# Altium schematic sheet 09. NET_Interface.SchDoc
size A4; CheckedBy: 黄钦宁; Author: 陈坤; DocumentNumber: 9; SheetNumber: 9; SheetTotal: 13; PageSetup: Record=PageOptions|CenterHorizontal=True|CenterVertical=True|PrintScale=1.00|XCorrection=1.00|YCorrection=1.00|PrintKind=0|BorderSize=5000000|LeftOffset=0|BottomOffset=0|Orientation=2|PaperLength=1000|PaperWidth=1000|Scale=100|PaperSource=7|PrintQuality=600|MediaType=1|DitherType=10|PaperKind=A4|PrintScaleMode=1; DesignDate: 2013-08-16; CheckDate: 2013-12-28; SheetName: NET_Interface; SheetVersion: V1.00; SheetDescription: NET_Interface; ProductName: EasyARM-iMX28学习套件; ProductModel: EasyARM-iMX283
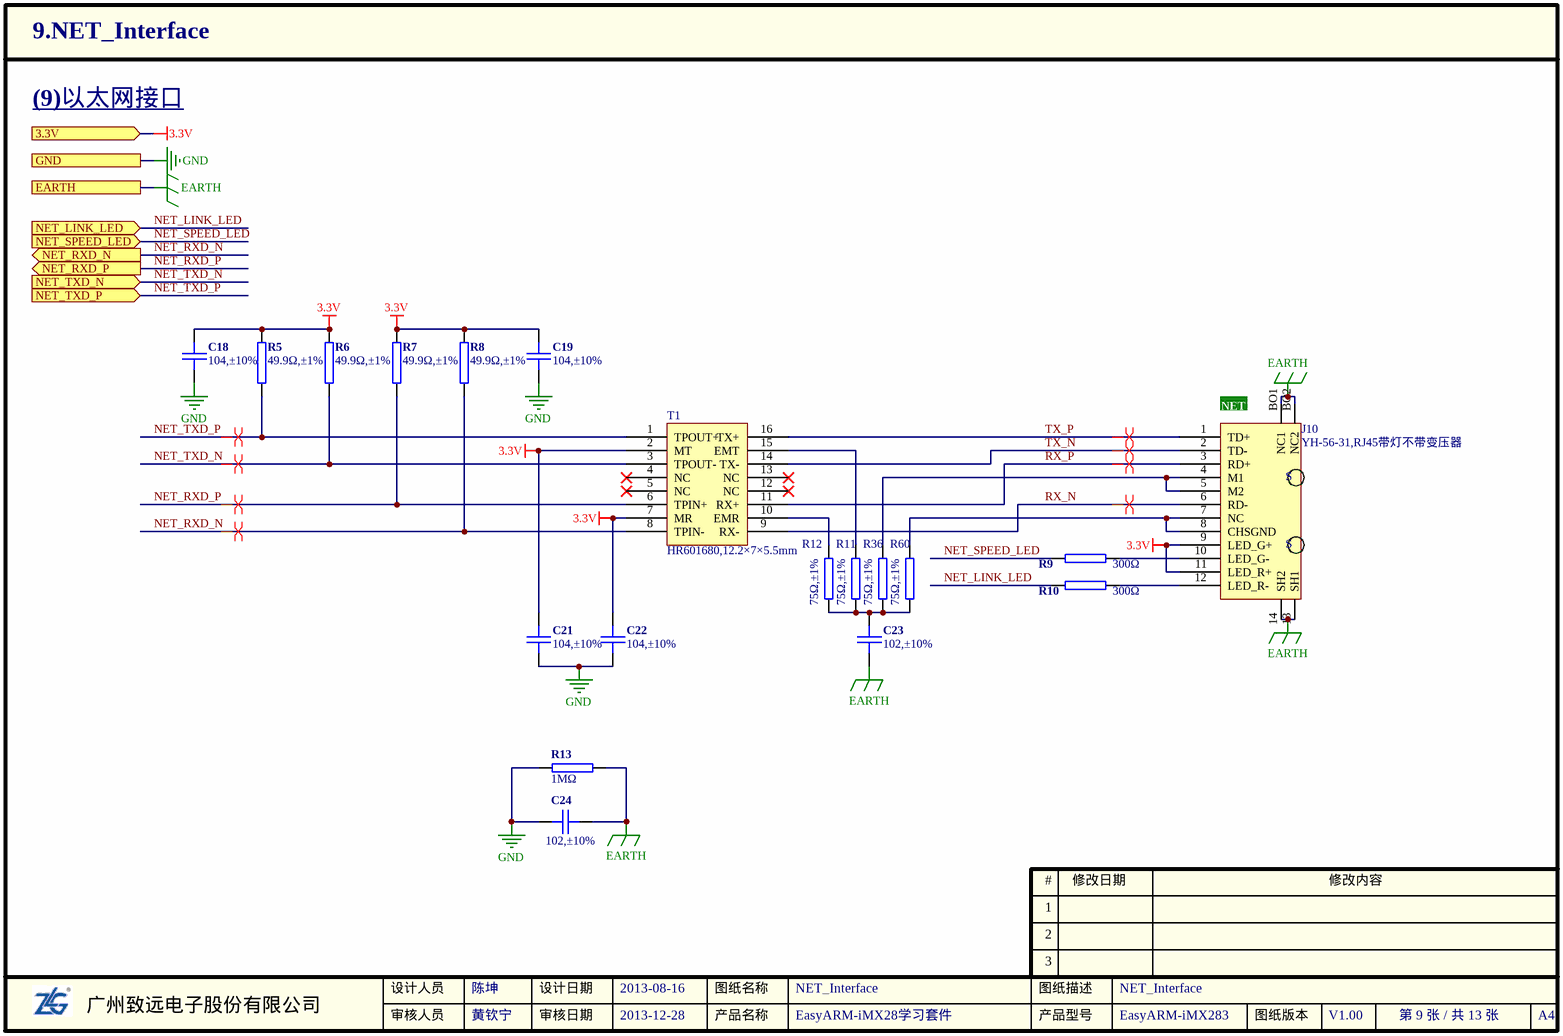
[diagram p0: 09. NET_Interface.SchDoc]

## Parts
C18  104,±10%  [0603C]
C19  104,±10%  [0603C]
C21  104,±10%  [0603C]
C22  104,±10%  [0603C]
C23  102,±10%  [1206C]
C24  102,±10%  [1206C]
J10  value YH-56-31,RJ45带灯不带变压器  [RJ45/LED]  (hidden comment: HR911105C)
R5  49.9Ω,±1%  [0603R]
R6  49.9Ω,±1%  [0603R]
R7  49.9Ω,±1%  [0603R]
R8  49.9Ω,±1%  [0603R]
R9  300Ω  [0603R]
R10  300Ω  [0603R]
R11  75Ω,±1%  [0603R]
R12  75Ω,±1%  [0603R]
R13  1MΩ  [1206R]
R36  75Ω,±1%  [0603R]
R60  75Ω,±1%  [0603R]
T1  value HR601680,12.2×7×5.5mm  [TRAN16-12R2X7X5R5-SM]  (hidden comment: HR601680)

## Ports
3.3V, EARTH, GND, NET_LINK_LED (in), NET_RXD_N (out), NET_RXD_P (out), NET_SPEED_LED (in), NET_TXD_N (in), NET_TXD_P (in)

## Nets
3.3V: C18.1 C19.1 C21.1 C22.1 J10.9(LED_G+) J10.11(LED_R+) R5.1 R6.1 R7.2 R8.1 T1.2(MT) T1.7(MR) ; port 3.3V
EARTH: C23.2 C24.2 J10.13(SH1) J10.14(SH2) J10.BO1(NC1) J10.BO2(NC2) R13.2 ; port EARTH
GND: C18.2 C19.2 C21.2 C22.2 C24.1 R13.1 ; port GND
NET_LINK_LED: R10.1 ; port NET_LINK_LED
NET_RXD_N: R8.2 T1.8(TPIN-) ; port NET_RXD_N
NET_RXD_P: R7.1 T1.6(TPIN+) ; port NET_RXD_P
NET_SPEED_LED: R9.1 ; port NET_SPEED_LED
NET_TXD_N: R6.2 T1.3(TPOUT-) ; port NET_TXD_N
NET_TXD_P: R5.2 T1.1(TPOUT+) ; port NET_TXD_P
RX_N: J10.6(RD-) T1.9(RX-)
RX_P: J10.3(RD+) T1.11(RX+)
TX_N: J10.2(TD-) T1.14(TX-)
TX_P: J10.1(TD+) T1.16(TX+)
NetC23_1: C23.1 R11.1 R12.1 R36.1 R60.1
NetJ10_4: J10.4(M1) J10.5(M2) R36.2
NetJ10_7: J10.7(NC) J10.8(CHSGND) R60.2
NetJ10_10: J10.10(LED_G-) R9.2
NetJ10_12: J10.12(LED_R-) R10.2
NetR11_2: R11.2 T1.15(EMT)
NetR12_2: R12.2 T1.10(EMR)

Not connected (* = marked no-connect by the designer): T1 4(NC)* 5(NC)* 12(NC)* 13(NC)*

## Layout directives
differential pair: NET_RXD_N, NET_RXD_P, NET_TXD_N, NET_TXD_P, RX_N, RX_P, TX_N, TX_P

## Notes on the sheet
- (9)以太网接口
- (near J10) NET
- 1
- #
- 修改日期
- 修改内容
- 2
- 3
- 广州致远电子股份有限公司
- 设计人员
- 审核人员
- 设计日期
- 审核日期
- 产品名称
- 图纸名称
- 产品型号
- 图纸描述
- 图纸版本
- A4
- (in symbol 1.10.05.0062) S

## Library data of the parts
C18 C19 C21 C22 = 1.02.01.0032: 104,±10%,50V,X7R,0603,*,RoHS; 名称: 电容; 封装: 0603; 设备封装名称: C0603_104_X7R_50V_10%; 贴片和直插: SMT; 物料代码: 1.02.01.0032; Value: 104,±10%; RoHS: RoHS; 型号: 104,±10%,50V,X7R; ComponentLink1Description: ErpDataInfo; ComponentLink1URL: http://erp.zlgmcu.com/ErpExt/ErpData/ListMateriel.aspx?pkey=1.02.01.0032
C23 = 1.02.03.0003: 102,±10%,2KV,X7R,1206,*,RoHS; 名称: 电容; 封装: 1206; 设备封装名称: C1206_102_X7R_2KV_10%; 贴片和直插: SMT; 物料代码: 1.02.03.0003; Value: 102,±10%; RoHS: RoHS; 型号: 102,±10%,2KV,X7R; ComponentLink1Description: ErpDataInfo; ComponentLink1URL: http://erp.zlgmcu.com/ErpExt/ErpData/ListMateriel.aspx?pkey=1.02.03.0003
C24 = 1.02.03.0003: Capacitor; 名称: 电容; 规格型号: 102,±10%,2KV,X7R,1206,*,RoHS; 封装: 1206; 设备封装名称: C1206_102_X7R_2KV_10%; 贴片和直插: SMT; 现有库存: 26517; 物料代码: 1.02.03.0003; Value: 102,±10%; RoHS: RoHS; ComponentLink1Description: ErpDataInfo; ComponentLink1URL: http://erp.zlgmcu.com/ErpExt/ErpData/ListMateriel.aspx?pkey=1.02.03.0003
J10 = 1.10.05.0062: YH-56-31,RJ45带灯不带变压器; 名称: 网线插座; 贴片和直插: THT; 物料代码: 1.10.05.0062; 型号: YH-56-31,RJ45带灯不带变压器; ComponentLink1Description: ErpDataInfo; ComponentLink1URL: http://erp.zlgmcu.com/ErpExt/ErpData/ListMateriel.aspx?pkey=1.10.05.0062
R5-R8 = 1.01.01.0018: 49.9Ω,±1%,0603,*,RoHS; 名称: 电阻; 封装: 0603; 设备封装名称: R0603_49.9R_1%; 贴片和直插: SMT; 物料代码: 1.01.01.0018; Value: 49.9Ω,±1%; RoHS: RoHS; 型号: 49.9Ω,±1%; ComponentLink1Description: ErpDataInfo; ComponentLink1URL: http://erp.zlgmcu.com/ErpExt/ErpData/ListMateriel.aspx?pkey=1.01.01.0018
R9 R10 = 1.01.01.0030: 300Ω,0603,*,RoHS; 名称: 电阻; 封装: 0603; 设备封装名称: R0603_300R; 贴片和直插: SMT; 物料代码: 1.01.01.0030; Value: 300Ω; RoHS: RoHS; 型号: 300Ω; ComponentLink1Description: ErpDataInfo; ComponentLink1URL: http://erp.zlgmcu.com/ErpExt/ErpData/ListMateriel.aspx?pkey=1.01.01.0030
R11 R12 R36 R60 = 1.01.01.0021: 75Ω,±1%,0603,*,RoHS; 名称: 电阻; 封装: 0603; 设备封装名称: R0603_75R_1%; 贴片和直插: SMT; 物料代码: 1.01.01.0021; Value: 75Ω,±1%; RoHS: RoHS; 型号: 75Ω,±1%; ComponentLink1Description: ErpDataInfo; ComponentLink1URL: http://erp.zlgmcu.com/ErpExt/ErpData/ListMateriel.aspx?pkey=1.01.01.0021
R13 = 1.01.03.0019: 名称: 电阻; 规格型号: 1MΩ,1206,RoHS; 封装: 1206; 设备封装名称: R1206_1M; 贴片和直插: SMT; 现有库存: 12252; 物料代码: 1.01.03.0019; Value: 1MΩ; RoHS: RoHS; ComponentLink1Description: ErpDataInfo; ComponentLink1URL: http://erp.zlgmcu.com/ErpExt/ErpData/ListMateriel.aspx?pkey=1.01.03.0019
T1 = 1.06.06.0002: HR601680,12.2×7×5.5mm,SOP-16,RoHS; 名称: 网络变压器; 设备封装名称: SOP-16_HR601680_12.2x7x5.5; 贴片和直插: SMT; 物料代码: 1.06.06.0002; 封装: SOP-16; RoHS: RoHS; 型号: HR601680,12.2×7×5.5mm; ComponentLink1Description: ErpDataInfo; ComponentLink1URL: http://erp.zlgmcu.com/ErpExt/ErpData/ListMateriel.aspx?pkey=1.06.06.0002